# Altium schematic sheet TIDA-010967_xWRL6432_Chip.SchDoc: xWRL6432AOP_CHIP
size 431 x 279 mm; Date: Not shown in title block; ApprovedBy: Not shown in title block; CheckedBy: Not shown in title block; Author: Not shown in title block; CompanyName: Not shown in title block; DrawnBy: Justin Yin; Engineer: Not shown in title block; Organization: Not shown in title block; Address1: Not shown in title block; Address2: Not shown in title block; Address3: Not shown in title block; Address4: Not shown in title block; DocumentNumber: 5; Revision: Use project parameter SCH_Rev; SheetNumber: 5; SheetTotal: 8; PageSetup: Record=PageOptions|CenterHorizontal=True|CenterVertical=True|PrintScale=1.00|XCorrection=1.00|YCorrection=1.00|PrintKind=0|BorderSize=5000000|LeftOffset=0|BottomOffset=0|Orientation=2|PaperLength=1000|PaperWidth=1000|Scale=100|PaperSource=15|PrintQuality=600|MediaType=1|DitherType=10|PaperKind=Letter|PrintScaleMode=1; CurrentTime: Not shown in title block; CurrentDate: Not shown in title block; Time: Not shown in title block; DocumentFullPathAndName: Not shown in title block; DocumentName: Not shown in title block; ModifiedDate: Not shown in title block; ImagePath: Not shown in title block
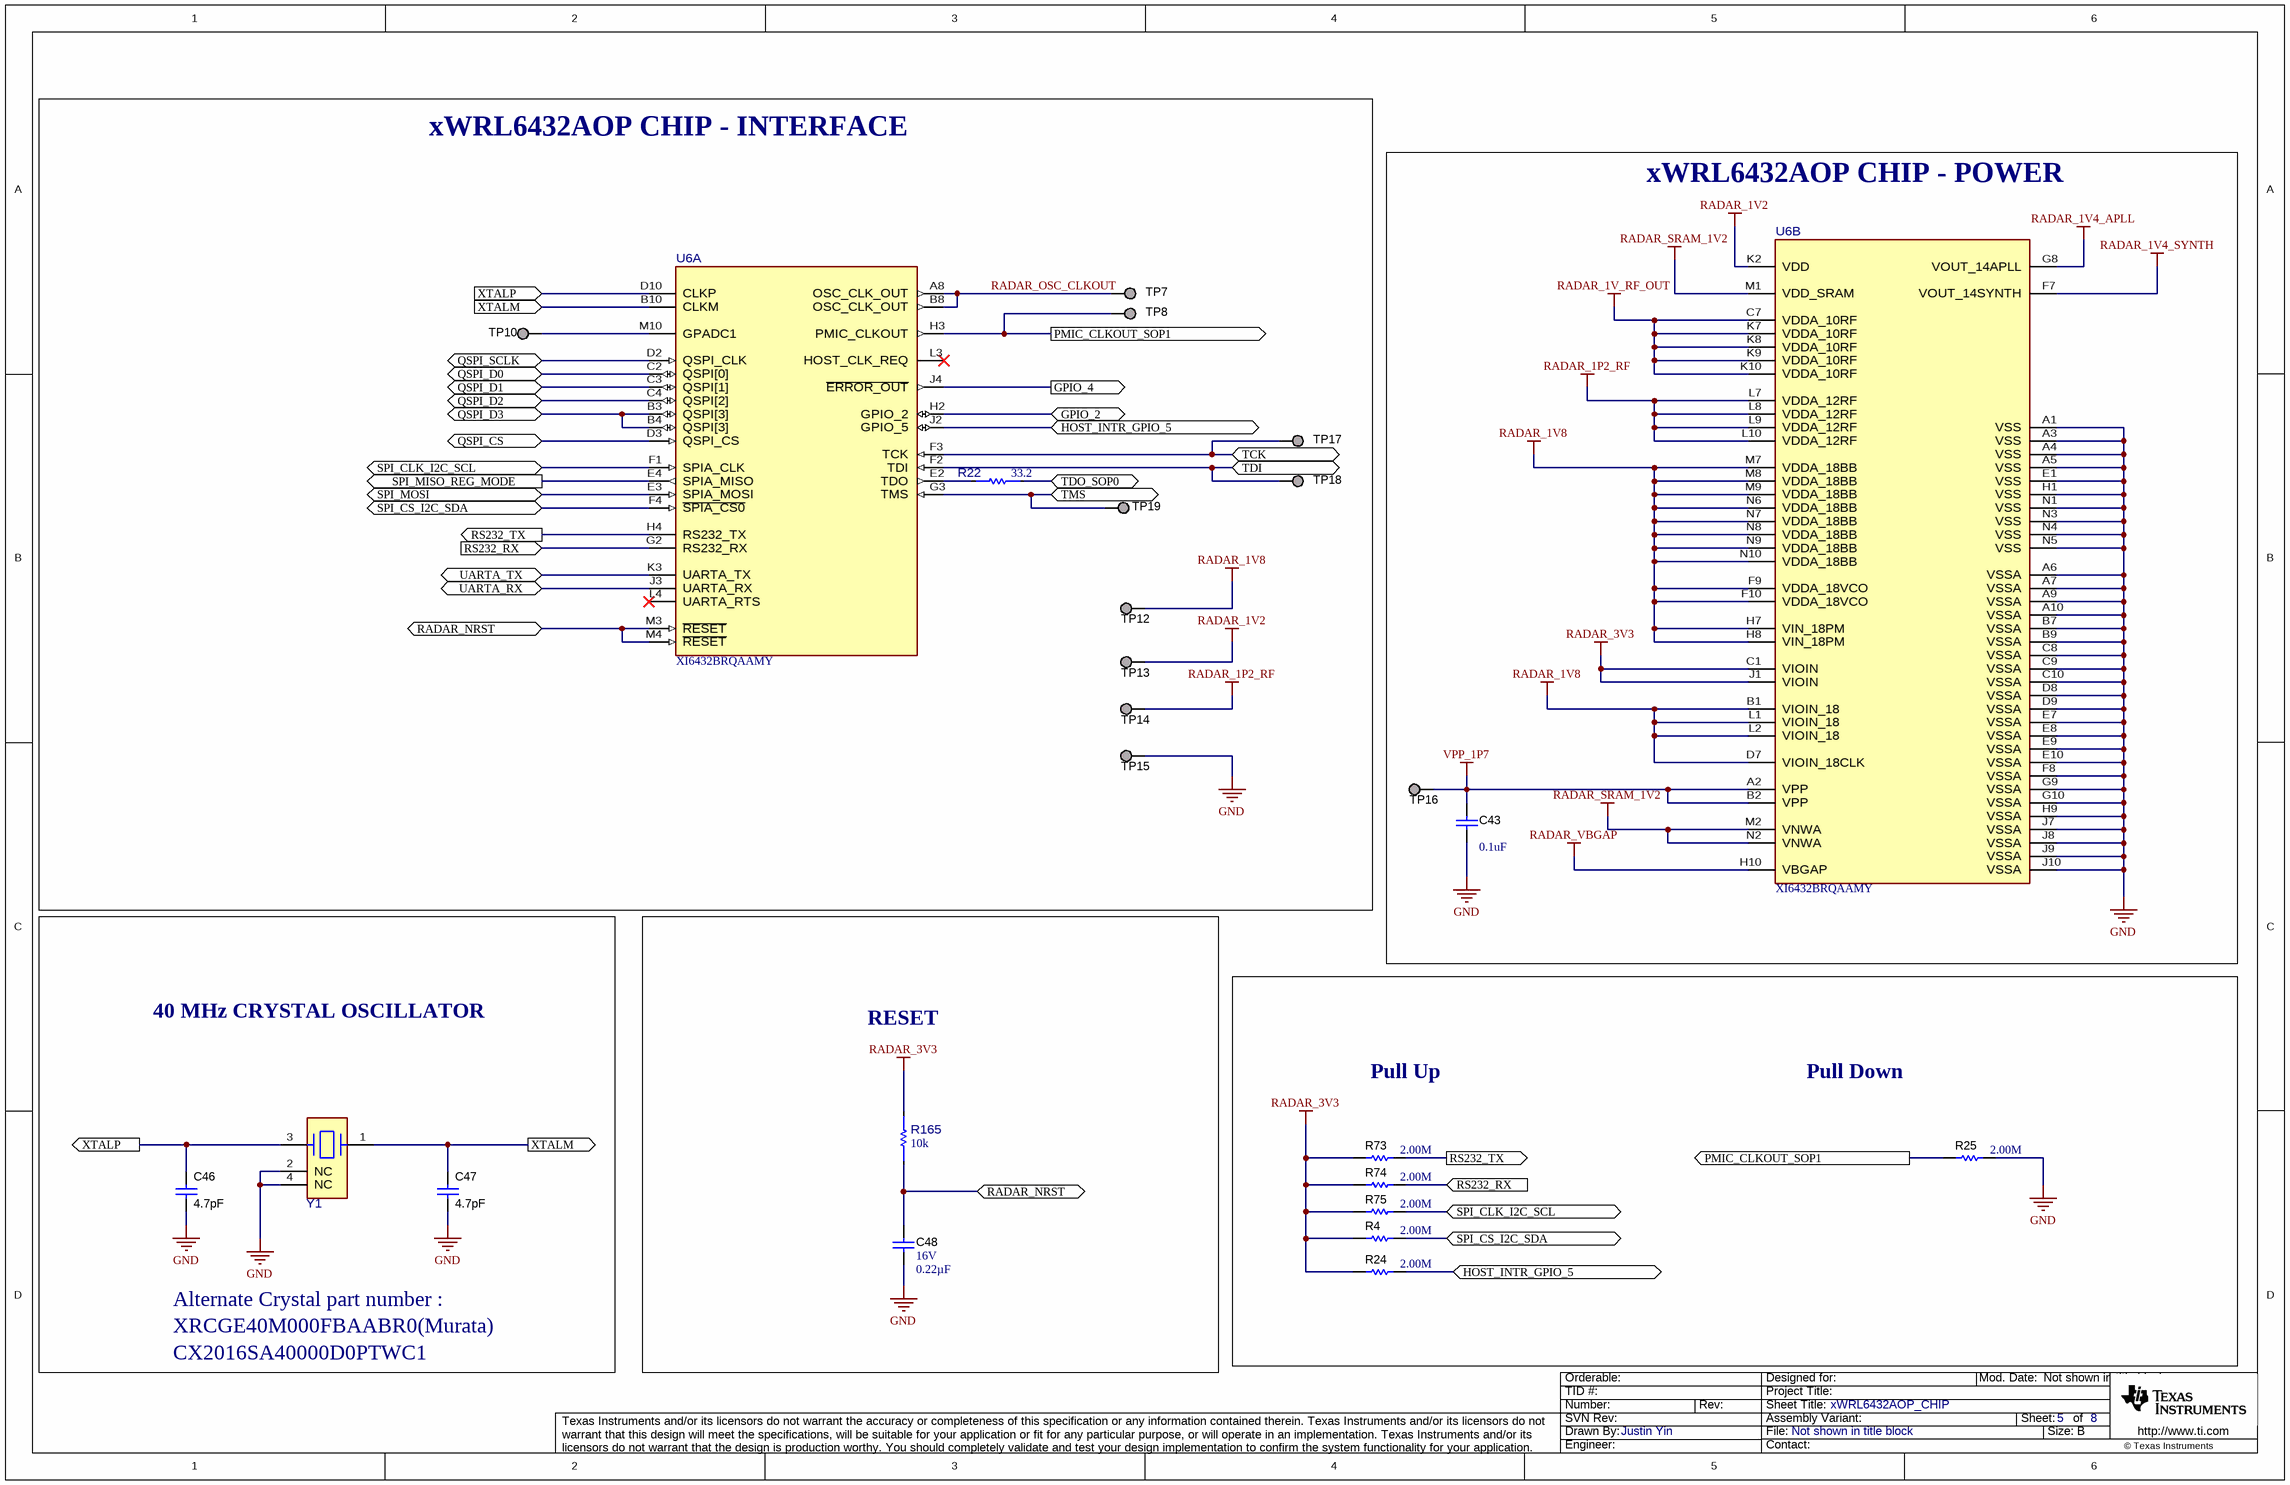
[diagram p0: TIDA-010967_xWRL6432_Chip.SchDoc]

## Parts
C43  ValueDisplayed: 0.1uF  [0402]  (hidden comment: C1005X7R1H104K050BE)
C46  ValueDisplayed: 4.7pF  [0402L]  (hidden comment: GJM1555C1H4R7BB01D)
C47  ValueDisplayed: 4.7pF  [0402L]  (hidden comment: GJM1555C1H4R7BB01D)
C48  VDC_V: 16V  ValueDisplayed: 0.22µF  [0402L]  (hidden comment: CL05B224KO5NNNC)
R4  ValueDisplayed: 2.00M  [0402]  (hidden comment: CRCW04022M00FKED)
R22  value 33.2  [FP-RT0402FRE0733R2L_0402-MFG]  (hidden comment: RT0402FRE0733R2L)
R24  ValueDisplayed: 2.00M  [0402]  (hidden comment: CRCW04022M00FKED)
R25  ValueDisplayed: 2.00M  [0402]  (hidden comment: CRCW04022M00FKED)
R73  ValueDisplayed: 2.00M  [0402]  (hidden comment: CRCW04022M00FKED)
R74  ValueDisplayed: 2.00M  [0402]  (hidden comment: CRCW04022M00FKED)
R75  ValueDisplayed: 2.00M  [0402]  (hidden comment: CRCW04022M00FKED)
R165  Res_ohm: 10k  [FP-ERJ-1RHD1002C_0201-MFG]  (hidden comment: ERJ-1RHD1002C)
TP7  TESTPOINT  [TP_25MIL-SMT]  (value not drawn)  (no BOM)
TP8  TESTPOINT  [TP_25MIL-SMT]  (value not drawn)  (no BOM)
TP10  TESTPOINT  [TP_25MIL-SMT]  (value not drawn)  (no BOM)
TP12  TESTPOINT  [TP_25MIL-SMT]  (value not drawn)  (no BOM)
TP13  TESTPOINT  [TP_25MIL-SMT]  (value not drawn)  (no BOM)
TP14  TESTPOINT  [TP_25MIL-SMT]  (value not drawn)  (no BOM)
TP15  TESTPOINT  [TP_25MIL-SMT]  (value not drawn)  (no BOM)
TP16  TESTPOINT  [TP_25MIL-SMT]  (value not drawn)  (no BOM)
TP17  TESTPOINT  [TP_25MIL-SMT]  (value not drawn)  (no BOM)
TP18  TESTPOINT  [TP_25MIL-SMT]  (value not drawn)  (no BOM)
TP19  TESTPOINT  [TP_25MIL-SMT]  (value not drawn)  (no BOM)
U6  XI6432BRQAAMY  [AMY0101A-MFG]  (parts A,B of 2)
Y1  XRCGB40M000F1S2GR0  [FP-XRCGB40M000F1S2GR0_SMT_CRYSTAL_2MM0_1MM6-MFG]  (value not drawn)

## Blocks framed on the sheet
xWRL6432AOP CHIP - INTERFACE: R22 TP7 TP8 TP10 TP12-TP15 TP17-TP19 U6
xWRL6432AOP CHIP - POWER: C43 TP16 U6
RESET: C48 R165

## Ports
GPIO_2 (bidir), GPIO_4 (out), HOST_INTR_GPIO_5 (bidir), PMIC_CLKOUT_SOP1 (out), QSPI_CS (bidir), QSPI_D0 (bidir), QSPI_D1 (bidir), QSPI_D2 (bidir), QSPI_D3 (bidir), QSPI_SCLK (bidir), RADAR_NRST (bidir), RS232_RX (in), RS232_TX (out), SPI_CLK_I2C_SCL (bidir), SPI_CS_I2C_SDA (bidir), SPI_MISO_REG_MODE (out), SPI_MOSI (bidir), TCK (bidir), TDI (bidir), TDO_SOP0 (bidir), TMS (bidir), UARTA_RX (bidir), UARTA_TX (bidir), XTALM (in), XTALM (out), XTALP (in), XTALP (out)

## Nets
GND: C43.2 C46.1 C47.1 C48.1 R25.2 TP15.1 U6.A1(VSS) U6.A3(VSS) U6.A4(VSS) U6.A5(VSS) U6.A6(VSSA) U6.A7(VSSA) U6.A9(VSSA) U6.A10(VSSA) U6.B7(VSSA) U6.B9(VSSA) U6.C8(VSSA) U6.C9(VSSA) U6.C10(VSSA) U6.D8(VSSA) U6.D9(VSSA) U6.E1(VSS) U6.E7(VSSA) U6.E8(VSSA) U6.E9(VSSA) U6.E10(VSSA) U6.F8(VSSA) U6.G9(VSSA) U6.G10(VSSA) U6.H1(VSS) U6.H9(VSSA) U6.J7(VSSA) U6.J8(VSSA) U6.J9(VSSA) U6.J10(VSSA) U6.N1(VSS) U6.N3(VSS) U6.N4(VSS) U6.N5(VSS) Y1.2(NC) Y1.4(NC)
RADAR_1P2_RF: TP14.1 U6.L7(VDDA_12RF) U6.L8(VDDA_12RF) U6.L9(VDDA_12RF) U6.L10(VDDA_12RF)
RADAR_1V2: TP13.1 U6.K2(VDD)
RADAR_1V4_APLL: U6.G8(VOUT_14APLL)
RADAR_1V4_SYNTH: U6.F7(VOUT_14SYNTH)
RADAR_1V8: TP12.1 U6.B1(VIOIN_18) U6.D7(VIOIN_18CLK) U6.F9(VDDA_18VCO) U6.F10(VDDA_18VCO) U6.H7(VIN_18PM) U6.H8(VIN_18PM) U6.L1(VIOIN_18) U6.L2(VIOIN_18) U6.M7(VDDA_18BB) U6.M8(VDDA_18BB) U6.M9(VDDA_18BB) U6.N6(VDDA_18BB) U6.N7(VDDA_18BB) U6.N8(VDDA_18BB) U6.N9(VDDA_18BB) U6.N10(VDDA_18BB)
RADAR_1V_RF_OUT: U6.C7(VDDA_10RF) U6.K7(VDDA_10RF) U6.K8(VDDA_10RF) U6.K9(VDDA_10RF) U6.K10(VDDA_10RF)
RADAR_3V3: R4.1 R24.1 R73.1 R74.1 R75.1 R165.2 U6.C1(VIOIN) U6.J1(VIOIN)
RADAR_SRAM_1V2: U6.M1(VDD_SRAM) U6.M2(VNWA) U6.N2(VNWA)
RADAR_VBGAP: U6.H10(VBGAP)
VPP_1P7: C43.1 TP16.1 U6.A2(VPP) U6.B2(VPP)
GPIO_2: U6.H2(GPIO_2) ; port GPIO_2
GPIO_4: U6.J4(~{ERROR_OUT}) ; port GPIO_4
HOST_INTR_GPIO_5: R24.2 U6.J2(GPIO_5) ; port HOST_INTR_GPIO_5
PMIC_CLKOUT_SOP1: R25.1 TP8.1 U6.H3(PMIC_CLKOUT) ; port PMIC_CLKOUT_SOP1
QSPI_CS: U6.D3(QSPI_CS) ; port QSPI_CS
QSPI_D0: U6.C2(QSPI[0]) ; port QSPI_D0
QSPI_D1: U6.C3(QSPI[1]) ; port QSPI_D1
QSPI_D2: U6.C4(QSPI[2]) ; port QSPI_D2
QSPI_D3: U6.B3(QSPI[3]) U6.B4(QSPI[3]) ; port QSPI_D3
QSPI_SCLK: U6.D2(QSPI_CLK) ; port QSPI_SCLK
RADAR_NRST: C48.2 R165.1 U6.M3(~{RESET}) U6.M4(~{RESET}) ; port RADAR_NRST
RADAR_OSC_CLKOUT: TP7.1 U6.A8(OSC_CLK_OUT) U6.B8(OSC_CLK_OUT)
RS232_RX: R74.2 U6.G2(RS232_RX) ; port RS232_RX
RS232_TX: R73.2 U6.H4(RS232_TX) ; port RS232_TX
SPI_CLK_I2C_SCL: R75.2 U6.F1(SPIA_CLK) ; port SPI_CLK_I2C_SCL
SPI_CS_I2C_SDA: R4.2 U6.F4(~{SPIA_CS0}) ; port SPI_CS_I2C_SDA
SPI_MISO_REG_MODE: U6.E4(SPIA_MISO) ; port SPI_MISO_REG_MODE
SPI_MOSI: U6.E3(SPIA_MOSI) ; port SPI_MOSI
TCK: TP17.1 U6.F3(TCK) ; port TCK
TDI: TP18.1 U6.F2(TDI) ; port TDI
TDO_SOP0: R22.1 ; port TDO_SOP0
TMS: TP19.1 U6.G3(TMS) ; port TMS
UARTA_RX: U6.J3(UARTA_RX) ; port UARTA_RX
UARTA_TX: U6.K3(UARTA_TX) ; port UARTA_TX
XTALM: C47.2 U6.B10(CLKM) Y1.1 ; port XTALM
XTALP: C46.2 U6.D10(CLKP) Y1.3 ; port XTALP
NetR22_2: R22.2 U6.E2(TDO)
NetTP10_1: TP10.1 U6.M10(GPADC1)

Not connected (* = marked no-connect by the designer): U6 L3(HOST_CLK_REQ)* L4(UARTA_RTS)*

## Notes on the sheet
- 40 MHz CRYSTAL OSCILLATOR
- Pull Up
- Pull Down
- Alternate Crystal part number :
- XRCGE40M000FBAABR0(Murata)
- CX2016SA40000D0PTWC1
- Drawn By:
- SVN Rev:
- Number:
- TID #:
- Orderable:
- Rev:
- Sheet Title:
- File:
- Project Title:
- Designed for:
- Assembly Variant:
- Mod. Date:
- Sheet:
- Size:
- of
- B
- http://www.ti.com
- Texas Instruments and/or its licensors do not warrant the accuracy or completeness of this specification or any information contained therein. Texas Instruments and/or its licensors do not warrant that this design will meet the specifications, will be suitable for your application or fit for any particular purpose, or will operate in an implementation. Texas Instruments and/or its licensors do not warrant that the design is production worthy. You should completely validate and test your design implementation to confirm the system functionality for your application.
- Engineer:
- Contact:
- © Texas Instruments

## Library data of the parts
C43 = CMP-0064946-2: CAP, CERM, 0.1 uF, 50 V,+/- 10%, X7R, 0402; Manufacturer: TDK; TaMin_C: -55°C; Polarized: N; SizeAreaWB_mm2: 3; Value1: Unknown; U/M: EA; Value: 0.1uF; TaMax_C: 125°C; SizeZ_mm: 0.6; SizeX_mm: 1; SizeY_mm: 0.5; Value2: 50V; Cap_F: 100nF; AEC Category: Q200; Supplier Part Number 2: 92Y5763; Publisher: Texas Instruments; Supplier 2: Newark; Supplier Part Number 3: 810-C1005X7R1H104KBE; TempCo: X7R; Supplier 3: Mouser; Published: 2008-06-19; RoHS: Y; MountType: SMT; Supplier 1: Digi-Key; PackageReference: 0402; Tolerance_%: 10%; Cap_Case: 0402; SizeArea_mm2: 0.5; CompType: Capacitor; LatestRevisionDate: 2017-06-05; PartNumber: C1005X7R1H104K050BE; AEC Qualified: N; VDC_V: 50V; ComponentLink1Description: Datasheet link; AEC Grade: N/A; Supplier Part Number 1: 445-173610-1-ND; Technology: Ceramic; ComponentLink1URL: https://product.tdk.com/info/en/catalog/datasheets/mlcc_commercial_soft_en.pdf
C46 C47 = CMP-0006367-2: CAP, CERM, 4.7 pF, 50 V, +/- 2%, C0G/NP0, 0402; Manufacturer: MuRata; TaMin_C: -55°C; Polarized: N; SizeAreaWB_mm2: 3; Value1: Unknown; U/M: EA; Value: 4.7pF; TaMax_C: 125°C; SizeZ_mm: 0.6; SizeX_mm: 1; SizeY_mm: 0.5; Cap_Case: 0402; Value2: 50V; CompType: Capacitor; AEC Category: Q200; Supplier Part Number 2: 81-GJM1555C1H4R7BB01; Publisher: Texas Instruments; Supplier 2: Mouser; TempCo: C0G/NP0; Published: 2008-06-19; RoHS: Y; MountType: SMT; Supplier 1: Digi-Key; PackageReference: 0402; Tolerance_%: 2%; SizeArea_mm2: 0.5; LatestRevisionDate: 2017-03-09; PartNumber: GJM1555C1H4R7BB01D; AEC Qualified: N; Cap_F: 4.7pF; VDC_V: 50V; ComponentLink1Description: Datasheet link; AEC Grade: N/A; Supplier Part Number 1: 490-8102-1-ND; Technology: Ceramic; ComponentLink1URL: http://psearch.murata.com/capacitor/product/GJM1555C1H4R7BB01%23.pdf
C48 = CMP-0860563-1: CAP, CERM, 0.22 µF, 16 V,+/- 10%, X7R, 0402; Manufacturer: Samsung Electro-Mechanics; SizeX_mm: 1; Cap_Case: 0402; Green_REACh: Incomplete; TaMin_C: -55°C; SizeArea_mm2: 0.5; TaMax_C: 125°C; U/M: EA; Green_Lifecycle: Active; SizeAreaWB_mm2: 3; AEC Qualified: N; SizeZ_mm: 0.6; AEC Category: Q200; Cap_F: 220nF; Value: 0.22uF; Green_EU RoHS: Passed; PartNumber: CL05B224KO5NNNC; Technology: Ceramic; CompType: Capacitor; RoHS: Y; Green_EU RoHS-2: Passed; TempCo: X7R; MountType: SMT; PackageReference: 0402; Tolerance_%: 10%; Polarized: N; Value2: 16V; ComponentLink1URL: http://www.samsungsem.com/kr/support/product-search/mlcc/__icsFiles/afieldfile/2019/06/18/CL05B224KO5NNNC-19.pdf; ComponentLink1Description: Datasheet link; AEC Grade: N/A; SizeY_mm: 0.5
R4 R24 R25 R73-R75 = CMP-0026245-2: RES, 2.00 M, 1%, 0.063 W, AEC-Q200 Grade 0, 0402; Manufacturer: Vishay-Dale; Power_W: 63mW; TempCo: 100 ppm/C; Value_Code: 2M00; Value: 2.00Meg; EIA_Code: E96; Res_ohm: 2M; SizeX_mm: 1; SizeY_mm: 0.5; SizeZ_mm: 0.6; Value2: 0.063W; AEC Qualified: Y; VDC_V: 50V; AEC Category: Q200; AEC Grade: 0; ComponentLink1URL: http://www.vishay.com/docs/20035/dcrcwe3.pdf; Supplier Part Number 2: 52K6816; Supplier 2: Newark; Supplier Part Number 3: 71-CRCW0402-2M-E3; Supplier 3: Mouser; RoHS: E; Value1: 1%; MountType: SMT; Supplier 1: Digi-Key; PackageReference: 0402; Tolerance_%: 1%; SizeArea_mm2: 0.5; CompType: Resistor; PartNumber: CRCW04022M00FKED; ComponentLink1Description: Datasheet link; Supplier Part Number 1: 541-2.00MLCT-ND; Technology: Thick Film
R22 = CMP-0120016-1: 33.2 Ohms ±1% 0.063W, 1/16W Chip Resistor 0402 (1005 Metric) Thin Film; Manufacturer: Yageo; AEC Qualified: No; Power_W: 63mW; SizeZ_mm: 0.35mm; TempCo: 50ppm/°C; VDC_V: 50V; PackageReference: 0402; PartNumber: RT0402FRE0733R2L; Res_ohm: 33.2; RoHS: TRUE; Supplier 1: Digikey; Supplier 2: Mouser; Supplier Part Number 1: 13-RT0402FRE0733R2LCT-ND; Supplier Part Number 2: 603-RT0402FRE0733R2L; Technology: Thin Film; Tolerance_%: 1%; Part Number: RT0402FRE0733R2L; datasheet: https://www.yageo.com/upload/media/product/productsearch/datasheet/rchip/PYu-RT_1-to-0.01_RoHS_L_15.pdf; Datasheet Path: datasheets/Res-RT0402FRE0733R2L.pdf; Digikey Description: RES SMD 33.2 OHM 1% 1/16W 0402; Digikey Part Number: 13-RT0402FRE0733R2LCT-ND; helpURL: https://upverter.com/upn/revision/fe73ddde98d0207b/; Lead Free: Yes; Mouser Part Number: 603-RT0402FRE0733R2L; Operating Temperature Range: -55°C to +155°C; Series: RT; ComponentLink1Description: Datasheet; ComponentLink1URL: https://www.yageo.com/upload/media/product/productsearch/datasheet/rchip/PYu-RT_1-to-0.01_RoHS_L_15.pdf
R165 = CMP-0095015-1: Res Thick Film 0201 10K Ohm 0.5% 0.05W ±50ppm/°C Molded SMD Pressed Carrier T/R; Manufacturer: Panasonic; SizeZ_mm: 0.26mm; AEC Qualified: No; VDC_V: 15V; Power_W: 50mW; Technology: Thick Film; Supplier 1: Digikey; TempCo: 50ppm/°C; Lead Free: Yes; Datasheet Path: datasheets/Res-ERJ-1RHD1002C.pdf; Part Number: ERJ-1RHD1002C; datasheet: https://industrial.panasonic.com/cdbs/www-data/pdf/RDA0000/AOA0000C304.pdf; Mouser Description: Current Sense Resistors 0201 10Kohms 0.5% Tolerance; ComponentLink1Description: Datasheet; PackageReference: 0201; helpURL: https://upverter.com/upn/revision/1ca8f4053101326f/; PartNumber: ERJ-1RHD1002C; Digikey Part Number: P15980CT-ND; Supplier Part Number 2: 667-ERJ-1RHD1002C; Supplier 2: Mouser; Digikey Description: RES SMD 10K OHM 0.5% 1/20W 0201; Operating Temperature Range: -55°C to +125°C; Mouser Part Number: 667-ERJ-1RHD1002C; Tolerance_%: 0.5%; Series: ERJ; ComponentLink1URL: https://industrial.panasonic.com/cdbs/www-data/pdf/RDA0000/AOA0000C304.pdf; RoHS: TRUE; Value: 10k; Supplier Part Number 1: P15980CT-ND
TP7 TP8 TP10 TP12-TP19 = CMP-0078143-4: TEST POINT.  No entry in BOM.; CompType: Testpoint; Manufacturer: N/A; PackageReference: N/A; PartNumber: N/A; Library Reference: TESTPOINT
U6 = CMP-0120794-2: Manufacturer: Texas Instruments; SizeZ_mm: 0.757mm; Standoff Height: 0.219mm; AEC Category: Q200; CompType: IC; PackageReference: FCCSP101; PartNumber: XI6432BRQAAMY; RoHS: UNKNOWN; Operating Temperature Range: to; Part Number: XI6432BRQAAMY; Datasheet Path: datasheets/IC-XI6432BRQAAMY.pdf; helpURL: https://upverter.com/upn/revision/bd36f950fb90ba88/; ComponentLink1Description: Datasheet Link; ComponentLink1URL: http://www.ti.com/lit/ds/symlink/GPN.pdf; ComponentLink2Description: Product Folder; ComponentLink2URL: http://www.ti.com/product/GPN; ComponentLink3Description: Online Datasheet; ComponentLink3URL: http://www.ti.com/product/GPN/datasheet; PartId: 1
Y1 = CMP-0120019-1: Crystal Resonator 40MHz ±10ppm (Tol) ±20ppm (Stability) 8pF 50Ohm 4-Pin SMD T/R; Manufacturer: Murata; SizeZ_mm: 0.7mm; AEC Qualified: No; Esr: 50; Frequency Stability: 20ppm; Frequency_Fixed: 40MHz; PackageReference: SMT_CRYSTAL_2MM0_1MM6; PartNumber: XRCGB40M000F1S2GR0; RoHS: TRUE; Frequency Tolerance: 10ppm; Load Capacitance: 8pF; Part Number: XRCGB40M000F1S2GR0; datasheet: https://www.murata.com/en-global/products/productdetail?partno=XRCGB40M000F1S2GR0; Datasheet Path: datasheets/Crys-XRCGB40M000F1S2GR0.pdf; helpURL: https://upverter.com/upn/revision/c49e01f65015ed60/; Lead Free: Yes; Operating Temperature Range: -40°C to +105°C; Series: XRCGB; Tolerance_%: 10ppm; ComponentLink1Description: Datasheet; ComponentLink1URL: https://www.murata.com/en-global/products/productdetail?partno=XRCGB40M000F1S2GR0